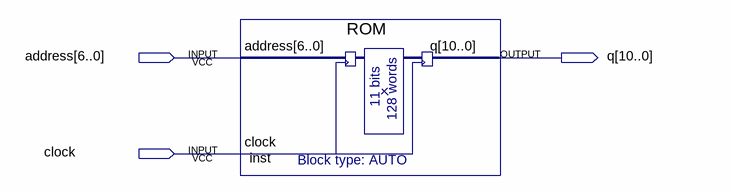
[diagram p0: schematic sheet]
// Quartus schematic Rom.bdf as structural Verilog: 1 symbols, 3 pins
module Rom (
  input  [6:0] address,
  input  clock,
  output [10:0] q
);

  ROM inst (.address(address), .clock(clock), .q(q));
endmodule
